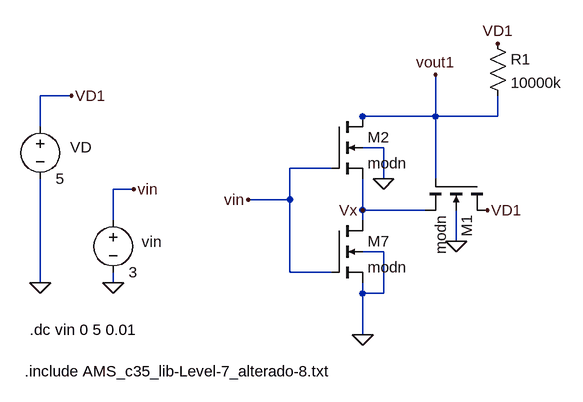
[diagram p0: schematic Schmitt-NMOS.asc]
Schmitt-NMOS.asc, the LTspice schematic file:
Version 4
SHEET 1 1512 1188
WIRE -1440 80 -1488 80
WIRE -880 112 -880 48
WIRE -880 112 -992 112
WIRE -784 112 -784 80
WIRE -784 112 -880 112
WIRE -1488 128 -1488 80
WIRE -992 128 -992 112
WIRE -960 160 -992 160
WIRE -1040 192 -1104 192
WIRE -960 208 -960 160
WIRE -880 208 -880 112
WIRE -1344 224 -1376 224
WIRE -1104 240 -1104 192
WIRE -1104 240 -1168 240
WIRE -992 256 -992 208
WIRE -896 256 -992 256
WIRE -1376 272 -1376 224
WIRE -992 272 -992 256
WIRE -848 304 -848 256
WIRE -960 320 -992 320
WIRE -1104 352 -1104 240
WIRE -1040 352 -1104 352
WIRE -1488 368 -1488 208
WIRE -1376 368 -1376 352
WIRE -992 384 -992 368
WIRE -960 384 -960 320
WIRE -960 384 -992 384
WIRE -992 448 -992 384
FLAG -1488 368 0
FLAG -1440 80 VD1
FLAG -1376 368 0
FLAG -1344 224 vin
FLAG -992 448 0
FLAG -1168 240 vin
FLAG -880 48 vout1
FLAG -960 208 0
FLAG -848 304 0
FLAG -800 256 VD1
FLAG -992 256 Vx
FLAG -784 0 VD1
SYMBOL voltage -1488 112 R0
WINDOW 0 46 47 Left 2
WINDOW 123 0 0 Left 2
WINDOW 39 0 0 Left 2
SYMATTR InstName VD
SYMATTR Value 5
SYMBOL voltage -1376 256 R0
WINDOW 0 44 49 Left 2
WINDOW 123 0 0 Left 2
WINDOW 39 0 0 Left 2
SYMATTR InstName vin
SYMATTR Value 3
SYMBOL nmos4 -1040 272 R0
SYMATTR InstName M7
SYMATTR Value modn
SYMATTR Value2 l=0.5u w=10u
SYMBOL nmos4 -1040 112 R0
SYMATTR InstName M2
SYMATTR Value modn
SYMATTR Value2 l=0.5u w=10u
SYMBOL nmos4 -800 208 R90
SYMATTR InstName M1
SYMATTR Value modn
SYMATTR Value2 l=0.5u w=10u
SYMBOL res -800 -16 R0
SYMATTR InstName R1
SYMATTR Value 10000k
TEXT -1504 440 Left 2 !.dc vin 0 5 0.01
TEXT -1512 504 Left 2 !.include AMS_c35_lib-Level-7_alterado-8.txt

The netlist it stands for:
* Schmitt-NMOS.asc
VD VD1 0 5
vin vin 0 3
M7 Vx vin 0 0 modn l=0.5u w=10u
M2 vout1 vin Vx 0 modn l=0.5u w=10u
M1 VD1 vout1 Vx 0 modn l=0.5u w=10u
R1 VD1 vout1 10000k
.model NMOS NMOS
.model PMOS PMOS
.lib standard.mos
.dc vin 0 5 0.01
.include AMS_c35_lib-Level-7_alterado-8.txt
.backanno
.end